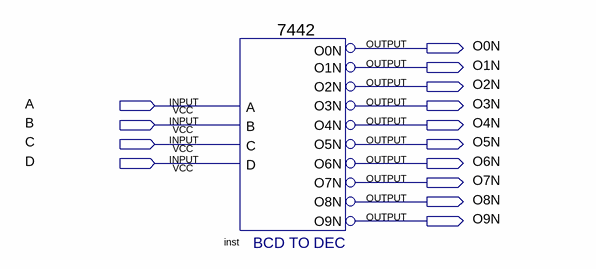
[diagram p0: schematic sheet]
// Quartus schematic 3.bdf as structural Verilog: 1 symbols, 14 pins
module \3  (
  input  A,
  input  B,
  input  C,
  input  D,
  output O0N,
  output O1N,
  output O2N,
  output O3N,
  output O4N,
  output O5N,
  output O6N,
  output O7N,
  output O8N,
  output O9N
);

  \7442  inst (
    .D(D), .B(B), .C(C), .A(A), .O7N(O7N), .O8N(O8N), .O9N(O9N), .O0N(O0N), .O3N(O3N), .O2N(O2N), .O1N(O1N),
    .O6N(O6N), .O5N(O5N), .O4N(O4N));
endmodule
